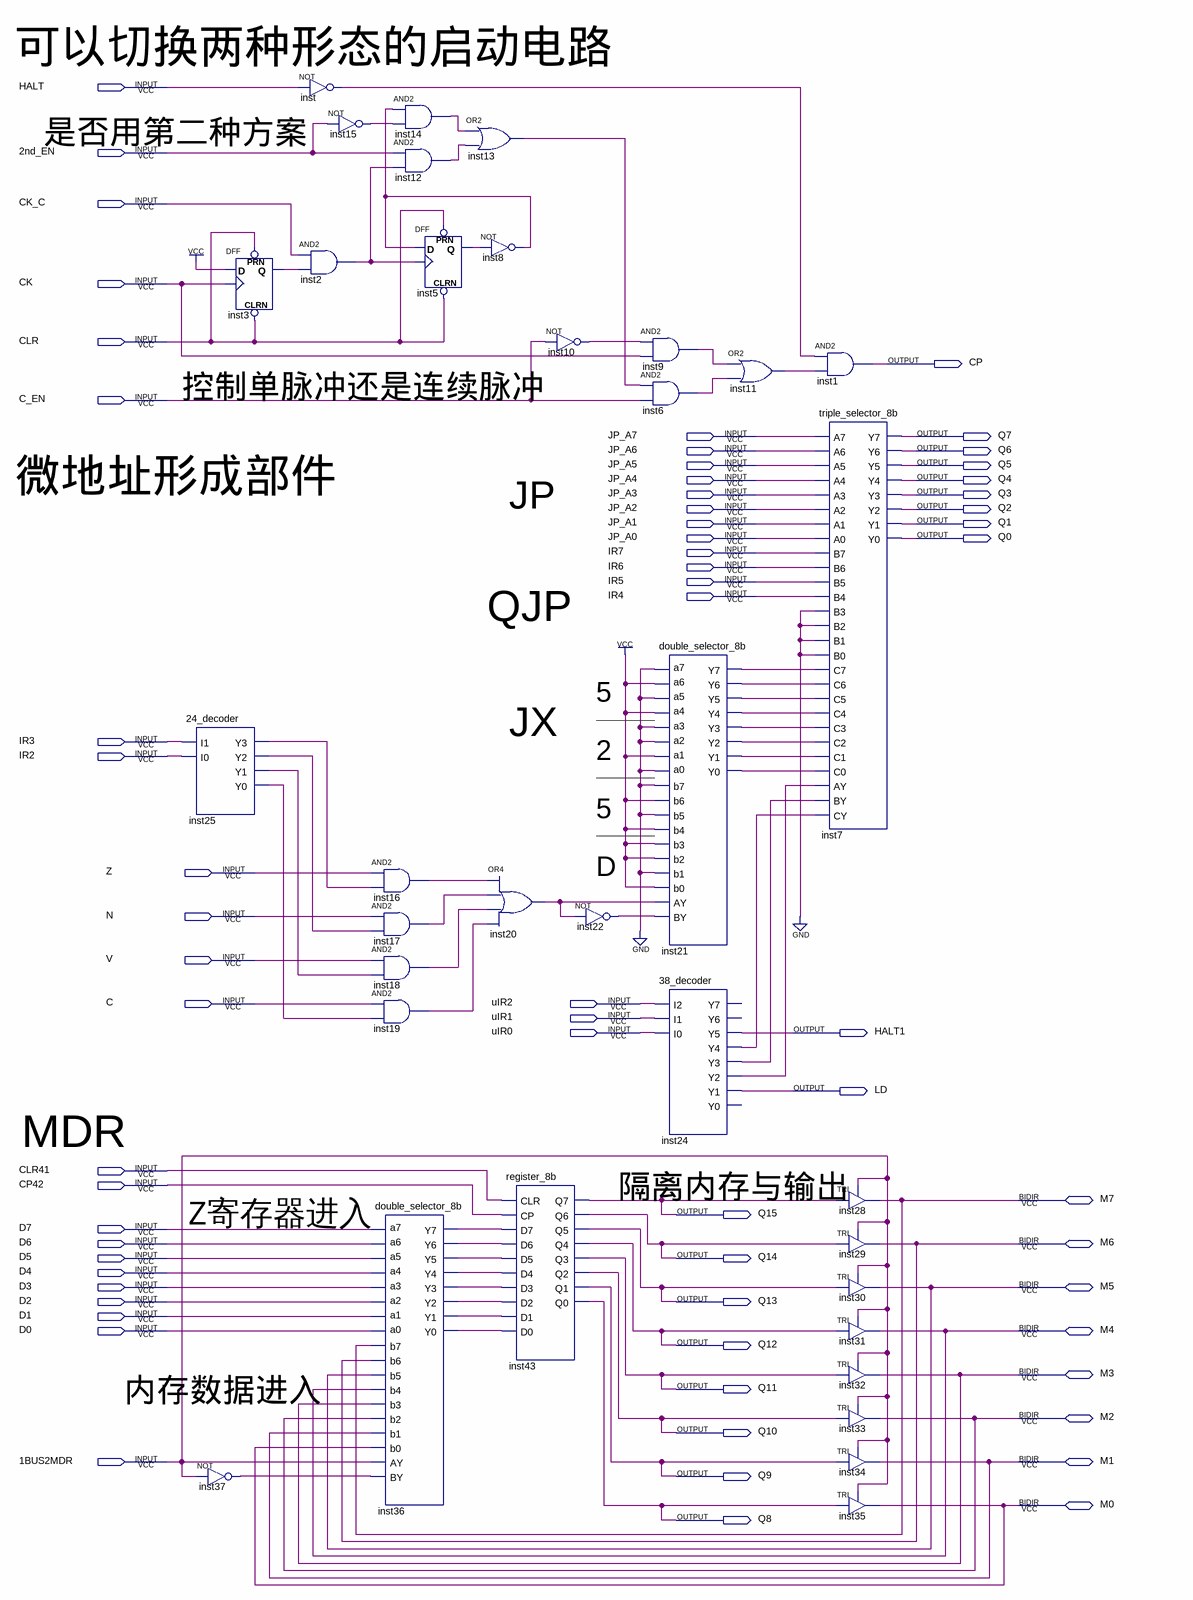
[diagram p0: schematic sheet]
// Quartus schematic print1.bdf as structural Verilog: 35 symbols, 65 pins
module print1 (
  input  HALT,
  input  \2nd_EN ,
  input  CK_C,
  input  CK,
  input  CLR,
  input  C_EN,
  input  JP_A7,
  input  JP_A6,
  input  JP_A5,
  input  JP_A4,
  input  JP_A3,
  input  JP_A2,
  input  JP_A1,
  input  JP_A0,
  input  IR7,
  input  IR6,
  input  IR5,
  input  IR4,
  input  IR3,
  input  IR2,
  input  Z,
  input  N,
  input  V,
  input  C,
  input  uIR2,
  input  uIR1,
  input  uIR0,
  input  CLR41,
  input  CP42,
  input  D7,
  input  D6,
  input  D5,
  input  D4,
  input  D3,
  input  D2,
  input  D1,
  input  D0,
  input  \1BUS2MDR ,
  inout  M7,
  inout  M6,
  inout  M5,
  inout  M4,
  inout  M3,
  inout  M2,
  inout  M1,
  inout  M0,
  output CP,
  output Q7,
  output Q6,
  output Q5,
  output Q4,
  output Q3,
  output Q2,
  output Q1,
  output Q0,
  output HALT1,
  output LD,
  output Q15,
  output Q14,
  output Q13,
  output Q12,
  output Q11,
  output Q10,
  output Q9,
  output Q8
);

  wire inst2_out, inst3_q, inst5_q, inst6_out, inst8_out, inst9_out, inst10_out, inst11_out, inst12_out,
       inst13_out, inst14_out, inst15_out, inst16_out, inst17_out, inst18_out, inst19_out, inst20_out,
       inst21_y0, inst21_y1, inst21_y2, inst21_y3, inst21_y4, inst21_y5, inst21_y6, inst21_y7, inst22_out,
       inst24_y2, inst24_y3, inst24_y4, inst25_y0, inst25_y1, inst25_y2, inst25_y3, inst36_y0, inst36_y1,
       inst36_y2, inst36_y3, inst36_y4, inst36_y5, inst36_y6, inst36_y7, inst37_out, inst_out;

  \24_decoder  inst25 (.I1(IR3), .I0(IR2), .Y3(inst25_y3), .Y2(inst25_y2), .Y1(inst25_y1), .Y0(inst25_y0));
  DFF inst3 (.CLRN(CLR), .CLK(CK), .D(1'b1), .PRN(CLR), .Q(inst3_q));
  not inst37 (inst37_out, \1BUS2MDR );
  not inst (inst_out, HALT);
  and inst2 (inst2_out, CK_C, inst3_q);
  not inst15 (inst15_out, \2nd_EN );
  and inst14 (inst14_out, inst8_out, inst15_out);
  and inst12 (inst12_out, \2nd_EN , inst2_out);
  DFF inst5 (.CLRN(CLR), .CLK(inst2_out), .D(inst8_out), .PRN(CLR), .Q(inst5_q));
  and inst16 (inst16_out, Z, inst25_y3);
  and inst17 (inst17_out, N, inst25_y2);
  and inst18 (inst18_out, V, inst25_y1);
  and inst19 (inst19_out, C, inst25_y0);
  double_selector_8b inst36 (
    .a0(D0), .a1(D1), .a2(D2), .a3(D3), .a4(D4), .a5(D5), .a6(D6), .a7(D7), .b0(M0), .b1(M1), .b2(M2),
    .b3(M3), .b4(M4), .b5(M5), .b6(M6), .b7(M7), .AY(\1BUS2MDR ), .BY(inst37_out), .Y0(inst36_y0),
    .Y1(inst36_y1), .Y2(inst36_y2), .Y3(inst36_y3), .Y4(inst36_y4), .Y5(inst36_y5), .Y6(inst36_y6),
    .Y7(inst36_y7));
  or inst13 (inst13_out, inst14_out, inst12_out);
  not inst8 (inst8_out, inst5_q);
  or inst20 (inst20_out, inst16_out, inst17_out, inst18_out, inst19_out);
  register_8b inst43 (
    .CLR(CLR41), .CP(CP42), .D7(inst36_y7), .D6(inst36_y6), .D5(inst36_y5), .D4(inst36_y4), .D3(inst36_y3),
    .D2(inst36_y2), .D1(inst36_y1), .D0(inst36_y0), .Q7(Q15), .Q6(Q14), .Q5(Q13), .Q4(Q12), .Q3(Q11),
    .Q2(Q10), .Q1(Q9), .Q0(Q8));
  not inst10 (inst10_out, C_EN);
  not inst22 (inst22_out, inst20_out);
  and inst9 (inst9_out, inst10_out, CK);
  and inst6 (inst6_out, inst13_out, C_EN);
  double_selector_8b inst21 (
    .a0(1'b0), .a1(1'b1), .a2(1'b0), .a3(1'b0), .a4(1'b1), .a5(1'b0), .a6(1'b1), .a7(1'b0), .b0(1'b1),
    .b1(1'b0), .b2(1'b1), .b3(1'b1), .b4(1'b1), .b5(1'b0), .b6(1'b1), .b7(1'b0), .AY(inst20_out),
    .BY(inst22_out), .Y0(inst21_y0), .Y1(inst21_y1), .Y2(inst21_y2), .Y3(inst21_y3), .Y4(inst21_y4),
    .Y5(inst21_y5), .Y6(inst21_y6), .Y7(inst21_y7));
  \38_decoder  inst24 (
    .I2(uIR2), .I1(uIR1), .I0(uIR0), .Y5(HALT1), .Y4(inst24_y4), .Y3(inst24_y3), .Y2(inst24_y2), .Y1(LD));  // open: Y7, Y6, Y0
  or inst11 (inst11_out, inst9_out, inst6_out);
  and inst1 (CP, inst_out, inst11_out);
  triple_selector_8b inst7 (
    .A7(JP_A7), .B7(IR7), .C7(inst21_y7), .A6(JP_A6), .B6(IR6), .C6(inst21_y6), .A5(JP_A5), .B5(IR5),
    .C5(inst21_y5), .A4(JP_A4), .B4(IR4), .C4(inst21_y4), .A3(JP_A3), .B3(1'b0), .C3(inst21_y3), .A2(JP_A2),
    .B2(1'b0), .C2(inst21_y2), .A1(JP_A1), .B1(1'b0), .C1(inst21_y1), .A0(JP_A0), .B0(1'b0), .C0(inst21_y0),
    .AY(inst24_y2), .BY(inst24_y3), .CY(inst24_y4), .Y7(Q7), .Y6(Q6), .Y5(Q5), .Y4(Q4), .Y3(Q3), .Y2(Q2),
    .Y1(Q1), .Y0(Q0));
  TRI inst28 (.IN(Q15), .OE(\1BUS2MDR ), .OUT(M7));
  TRI inst29 (.IN(Q14), .OE(\1BUS2MDR ), .OUT(M6));
  TRI inst30 (.IN(Q13), .OE(\1BUS2MDR ), .OUT(M5));
  TRI inst31 (.IN(Q12), .OE(\1BUS2MDR ), .OUT(M4));
  TRI inst32 (.IN(Q11), .OE(\1BUS2MDR ), .OUT(M3));
  TRI inst33 (.IN(Q10), .OE(\1BUS2MDR ), .OUT(M2));
  TRI inst34 (.IN(Q9), .OE(\1BUS2MDR ), .OUT(M1));
  TRI inst35 (.IN(Q8), .OE(\1BUS2MDR ), .OUT(M0));

  // Notes on the sheet:
  //   可以切换两种形态的启动电路
  //   是否用第二种方案
  //   控制单脉冲还是连续脉冲
  //   微地址形成部件
  //   JP
  //   QJP
  //   5
  //   JX
  //   2
  //   5
  //   D
  //   MDR
  //   隔离内存与输出
  //   Z寄存器进入
  //   内存数据进入
endmodule
